# Altium schematic sheet CNC.SchDoc
size A2
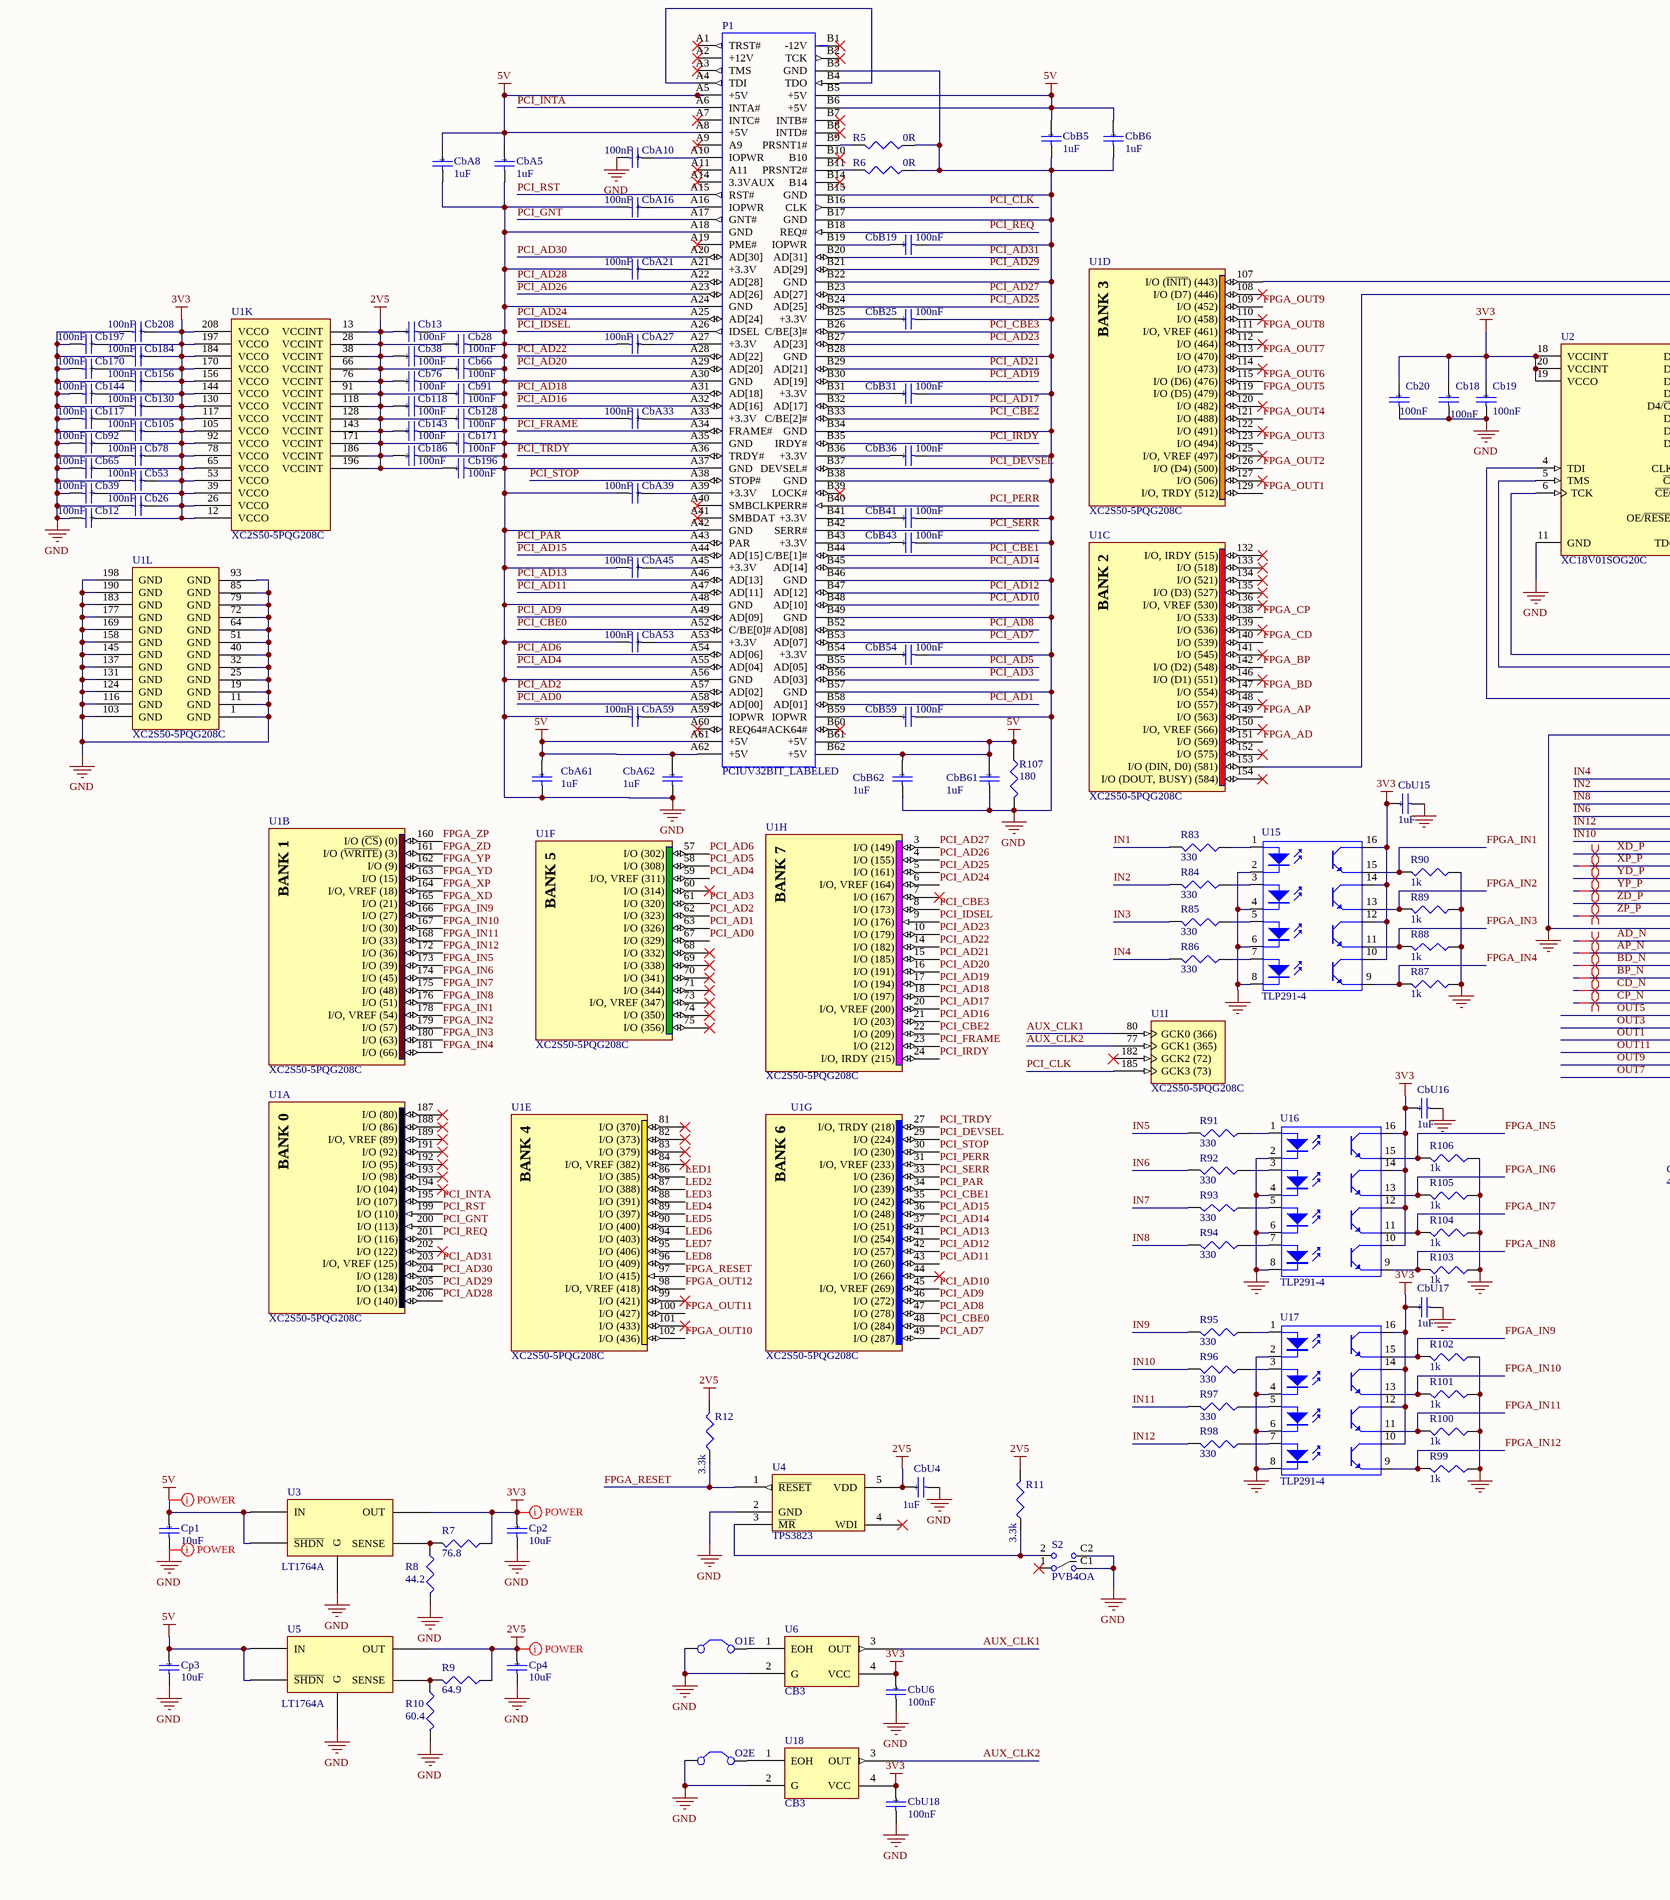
[diagram p0: CNC.SchDoc, bottom left]
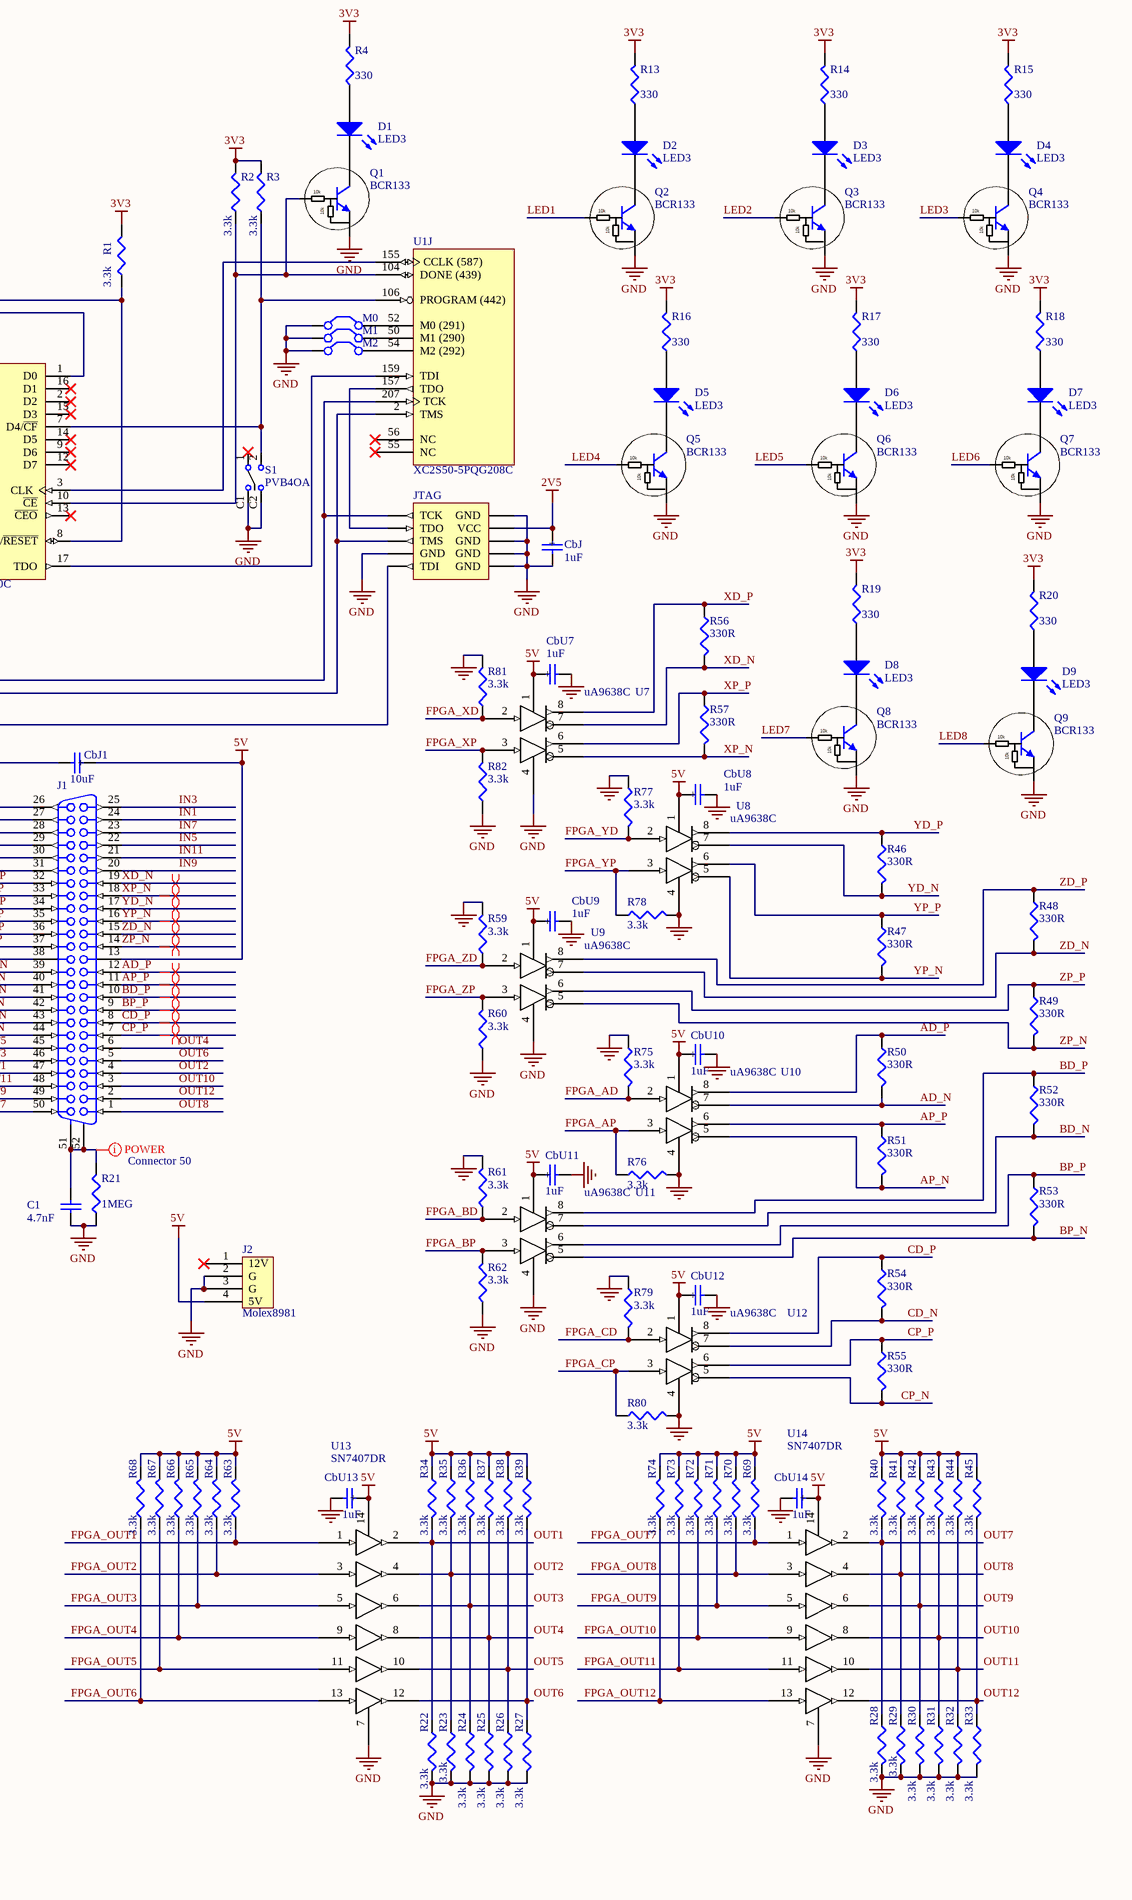
[diagram p1: CNC.SchDoc, bottom right]

## Parts
C1  4.7nF  [C1206]
Cb12  100nF  [C1206_POL]
Cb13  100nF  [C1206_POL]
Cb18  100nF  [C1206_POL]
Cb19  100nF  [C1206_POL]
Cb20  100nF  [C1206_POL]
Cb26  100nF  [C1206_POL]
Cb28  100nF  [C1206_POL]
Cb38  100nF  [C1206_POL]
Cb39  100nF  [C1206_POL]
Cb53  100nF  [C1206_POL]
Cb65  100nF  [C1206_POL]
Cb66  100nF  [C1206_POL]
Cb76  100nF  [C1206_POL]
Cb78  100nF  [C1206_POL]
Cb91  100nF  [C1206_POL]
Cb92  100nF  [C1206_POL]
Cb105  100nF  [C1206_POL]
Cb117  100nF  [C1206_POL]
Cb118  100nF  [C1206_POL]
Cb128  100nF  [C1206_POL]
Cb130  100nF  [C1206_POL]
Cb143  100nF  [C1206_POL]
Cb144  100nF  [C1206_POL]
Cb156  100nF  [C1206_POL]
Cb170  100nF  [C1206_POL]
Cb171  100nF  [C1206_POL]
Cb184  100nF  [C1206_POL]
Cb186  100nF  [C1206_POL]
Cb196  100nF  [C1206_POL]
Cb197  100nF  [C1206_POL]
Cb208  100nF  [C1206_POL]
CbA5  1uF  [C1206_POL]
CbA8  1uF  [C1206_POL]
CbA10  100nF  [C1206_POL]
CbA16  100nF  [C1206_POL]
CbA21  100nF  [C1206_POL]
CbA27  100nF  [C1206_POL]
CbA33  100nF  [C1206_POL]
CbA39  100nF  [C1206_POL]
CbA45  100nF  [C1206_POL]
CbA53  100nF  [C1206_POL]
CbA59  100nF  [C1206_POL]
CbA61  1uF  [C1206_POL]
CbA62  1uF  [C1206_POL]
CbB5  1uF  [C1206_POL]
CbB6  1uF  [C1206_POL]
CbB19  100nF  [C1206_POL]
CbB25  100nF  [C1206_POL]
CbB31  100nF  [C1206_POL]
CbB36  100nF  [C1206_POL]
CbB41  100nF  [C1206_POL]
CbB43  100nF  [C1206_POL]
CbB54  100nF  [C1206_POL]
CbB59  100nF  [C1206_POL]
CbB61  1uF  [C1206_POL]
CbB62  1uF  [C1206_POL]
CbJ  1uF  [C1206_POL]
CbJ1  10uF  [C1206_POL]
CbU4  1uF  [C1206_POL]
CbU6  100nF  [C1206_POL]
CbU7  1uF  [C1206_POL]
CbU8  1uF  [C1206_POL]
CbU9  1uF  [C1206_POL]
CbU10  1uF  [C1206_POL]
CbU11  1uF  [C1206_POL]
CbU12  1uF  [C1206_POL]
CbU13  1uF  [C1206_POL]
CbU14  1uF  [C1206_POL]
CbU15  1uF  [C1206_POL]
CbU16  1uF  [C1206_POL]
CbU17  1uF  [C1206_POL]
CbU18  100nF  [C1206_POL]
Cp1  10uF  [C1206_POL]
Cp2  10uF  [C1206_POL]
Cp3  10uF  [C1206_POL]
Cp4  10uF  [C1206_POL]
D1  LED3  [3.5X2.8X1.9]
D2  LED3  [3.5X2.8X1.9]
D3  LED3  [3.5X2.8X1.9]
D4  LED3  [3.5X2.8X1.9]
D5  LED3  [3.5X2.8X1.9]
D6  LED3  [3.5X2.8X1.9]
D7  LED3  [3.5X2.8X1.9]
D8  LED3  [3.5X2.8X1.9]
D9  LED3  [3.5X2.8X1.9]
J1  Connector 50  [SCSI50]
J2  Molex8981  [molex8981]
JTAG  JTAG  [HDR2X5]  (value not drawn)
M0  M0  [RAD-0.2]  (value not drawn)
M1  M0  [RAD-0.2]  (value not drawn)
M2  M0  [RAD-0.2]  (value not drawn)
O1E  M0  [RAD-0.2]  (value not drawn)
O2E  M0  [RAD-0.2]  (value not drawn)
P1  PCIUV32BIT_LABELED  [PCIUV32BIT]
Q1  BCR133  [SOT-23B_L]
Q2  BCR133  [SOT-23B_L]
Q3  BCR133  [SOT-23B_L]
Q4  BCR133  [SOT-23B_L]
Q5  BCR133  [SOT-23B_L]
Q6  BCR133  [SOT-23B_L]
Q7  BCR133  [SOT-23B_L]
Q8  BCR133  [SOT-23B_L]
Q9  BCR133  [SOT-23B_L]
R1  3.3k  [J1-0603]
R2  3.3k  [J1-0603]
R3  3.3k  [J1-0603]
R4  value 330  [J1-0603]  (hidden comment: 330R)
R5  0R  [J1-0603]
R6  0R  [J1-0603]
R7  value 76.8  [14-1210]  (hidden comment: 76.8R1%)
R8  value 44.2  [14-1210]  (hidden comment: 44.2R1%)
R9  value 64.9  [14-1210]  (hidden comment: 64.9R1%)
R10  value 60.4  [14-1210]  (hidden comment: 60.4R1%)
R11  3.3k  [J1-0603]
R12  3.3k  [J1-0603]
R13  value 330  [J1-0603]  (hidden comment: 330R)
R14  value 330  [J1-0603]  (hidden comment: 330R)
R15  value 330  [J1-0603]  (hidden comment: 330R)
R16  value 330  [J1-0603]  (hidden comment: 330R)
R17  value 330  [J1-0603]  (hidden comment: 330R)
R18  value 330  [J1-0603]  (hidden comment: 330R)
R19  value 330  [J1-0603]  (hidden comment: 330R)
R20  value 330  [J1-0603]  (hidden comment: 330R)
R21  value 1MEG  [J1-0603]  (hidden comment: 1M)
R22  3.3k  [J1-0603]
R23  3.3k  [J1-0603]
R24  3.3k  [J1-0603]
R25  3.3k  [J1-0603]
R26  3.3k  [J1-0603]
R27  3.3k  [J1-0603]
R28  3.3k  [J1-0603]
R29  3.3k  [J1-0603]
R30  3.3k  [J1-0603]
R31  3.3k  [J1-0603]
R32  3.3k  [J1-0603]
R33  3.3k  [J1-0603]
R34  3.3k  [J1-0603]
R35  3.3k  [J1-0603]
R36  3.3k  [J1-0603]
R37  3.3k  [J1-0603]
R38  3.3k  [J1-0603]
R39  3.3k  [J1-0603]
R40  3.3k  [J1-0603]
R41  3.3k  [J1-0603]
R42  3.3k  [J1-0603]
R43  3.3k  [J1-0603]
R44  3.3k  [J1-0603]
R45  3.3k  [J1-0603]
R46  330R  [J1-0603]
R47  330R  [J1-0603]
R48  330R  [J1-0603]
R49  330R  [J1-0603]
R50  330R  [J1-0603]
R51  330R  [J1-0603]
R52  330R  [J1-0603]
R53  330R  [J1-0603]
R54  330R  [J1-0603]
R55  330R  [J1-0603]
R56  330R  [J1-0603]
R57  330R  [J1-0603]
R59  3.3k  [J1-0603]
R60  3.3k  [J1-0603]
R61  3.3k  [J1-0603]
R62  3.3k  [J1-0603]
R63  3.3k  [J1-0603]
R64  3.3k  [J1-0603]
R65  3.3k  [J1-0603]
R66  3.3k  [J1-0603]
R67  3.3k  [J1-0603]
R68  3.3k  [J1-0603]
R69  3.3k  [J1-0603]
R70  3.3k  [J1-0603]
R71  3.3k  [J1-0603]
R72  3.3k  [J1-0603]
R73  3.3k  [J1-0603]
R74  3.3k  [J1-0603]
R75  3.3k  [J1-0603]
R76  3.3k  [J1-0603]
R77  3.3k  [J1-0603]
R78  3.3k  [J1-0603]
R79  3.3k  [J1-0603]
R80  3.3k  [J1-0603]
R81  3.3k  [J1-0603]
R82  3.3k  [J1-0603]
R83  value 330  [J1-0603]  (hidden comment: 330R)
R84  value 330  [J1-0603]  (hidden comment: 330R)
R85  value 330  [J1-0603]  (hidden comment: 330R)
R86  value 330  [J1-0603]  (hidden comment: 330R)
R87  1k  [J1-0603]
R88  1k  [J1-0603]
R89  1k  [J1-0603]
R90  1k  [J1-0603]
R91  value 330  [J1-0603]  (hidden comment: 330R)
R92  value 330  [J1-0603]  (hidden comment: 330R)
R93  value 330  [J1-0603]  (hidden comment: 330R)
R94  value 330  [J1-0603]  (hidden comment: 330R)
R95  value 330  [J1-0603]  (hidden comment: 330R)
R96  value 330  [J1-0603]  (hidden comment: 330R)
R97  value 330  [J1-0603]  (hidden comment: 330R)
R98  value 330  [J1-0603]  (hidden comment: 330R)
R99  1k  [J1-0603]
R100  1k  [J1-0603]
R101  1k  [J1-0603]
R102  1k  [J1-0603]
R103  1k  [J1-0603]
R104  1k  [J1-0603]
R105  1k  [J1-0603]
R106  1k  [J1-0603]
R107  value 180  [14-1210]  (hidden comment: 180R)
S1  PVB4OA  [PVB4]
S2  PVB4OA  [PVB4]
U1  XC2S50-5PQG208C  [PQG208_N]  (parts A,B,C,D,E,F,G,H,I,J,K,L of 12)
U2  XC18V01SOG20C  [SOG20_N]
U3  LT1764A  [LT1764A]
U4  TPS3823  [SOT23-5]
U5  LT1764A  [LT1764A]
U6  CB3  [CB3]
U7  uA9638C  [SO8_N]
U8  uA9638C  [SO8_N]
U9  uA9638C  [SO8_N]
U10  uA9638C  [SO8_N]
U11  uA9638C  [SO8_N]
U12  uA9638C  [SO8_N]
U13  SN7407DR  [SO14]
U14  SN7407DR  [SO14]
U15  TLP291-4  [TOSHIBA_11_11F1]
U16  TLP291-4  [TOSHIBA_11_11F1]
U17  TLP291-4  [TOSHIBA_11_11F1]
U18  CB3  [CB3]

## Nets
2V5: Cb13.- Cb28.- Cb38.- Cb66.- Cb76.- Cb91.- Cb118.- Cb128.- Cb143.- Cb171.- Cb186.- Cb196.- CbJ.- CbU4.- Cp4.- JTAG.4(VCC) R9.1 R11.2 R12.2 U1.13(VCCINT) U1.28(VCCINT) U1.38(VCCINT) U1.66(VCCINT) U1.76(VCCINT) U1.91(VCCINT) U1.118(VCCINT) U1.128(VCCINT) U1.143(VCCINT) U1.171(VCCINT) U1.186(VCCINT) U1.196(VCCINT) U4.5(VDD) U5.OUT
3V3: Cb12.- Cb18.- Cb19.- Cb20.- Cb26.- Cb39.- Cb53.- Cb65.- Cb78.- Cb92.- Cb105.- Cb117.- Cb130.- Cb144.- Cb156.- Cb170.- Cb184.- Cb197.- Cb208.- CbU6.- CbU15.- CbU16.- CbU17.- CbU18.- Cp2.- R1.2 R2.2 R3.2 R4.2 R7.1 R13.2 R14.2 R15.2 R16.2 R17.2 R18.2 R19.2 R20.2 U1.12(VCCO) U1.26(VCCO) U1.39(VCCO) U1.53(VCCO) U1.65(VCCO) U1.78(VCCO) U1.92(VCCO) U1.105(VCCO) U1.117(VCCO) U1.130(VCCO) U1.144(VCCO) U1.156(VCCO) U1.170(VCCO) U1.184(VCCO) U1.197(VCCO) U1.208(VCCO) U2.18(VCCINT) U2.19(VCCO) U2.20(VCCINT) U3.OUT U6.4(VCC) U15.10 U15.12 U15.14 U15.16 U16.10 U16.12 U16.14 U16.16 U17.10 U17.12 U17.14 U17.16 U18.4(VCC)
5V: CbA5.- CbA8.- CbA61.- CbA62.- CbB5.- CbB6.- CbB61.- CbB62.- CbJ1.- CbU7.- CbU8.- CbU9.- CbU10.- CbU11.- CbU12.- CbU13.- CbU14.- Cp1.- Cp3.- J1.13 J2.4(5V) P1.A5(+5V) P1.A8(+5V) P1.A61(+5V) P1.A62(+5V) P1.B5(+5V) P1.B6(+5V) P1.B61(+5V) P1.B62(+5V) R34.1 R35.1 R36.1 R37.1 R38.1 R39.1 R40.1 R41.1 R42.1 R43.1 R44.1 R45.1 R63.2 R64.2 R65.2 R66.2 R67.2 R68.2 R69.2 R70.2 R71.2 R72.2 R73.2 R74.2 R107.1 U3.IN U3.SHDN(~{SHDN}) U5.IN U5.SHDN(~{SHDN}) U7.1 U8.1 U9.1 U10.1 U11.1 U12.1 U13.14 U14.14
GND: C1.1 Cb12.+ Cb13.+ Cb18.+ Cb19.+ Cb20.+ Cb26.+ Cb28.+ Cb38.+ Cb39.+ Cb53.+ Cb65.+ Cb66.+ Cb76.+ Cb78.+ Cb91.+ Cb92.+ Cb105.+ Cb117.+ Cb118.+ Cb128.+ Cb130.+ Cb143.+ Cb144.+ Cb156.+ Cb170.+ Cb171.+ Cb184.+ Cb186.+ Cb196.+ Cb197.+ Cb208.+ CbA5.+ CbA8.+ CbA10.+ CbA16.+ CbA21.+ CbA27.+ CbA33.+ CbA39.+ CbA45.+ CbA53.+ CbA59.+ CbA61.+ CbA62.+ CbB5.+ CbB6.+ CbB19.+ CbB25.+ CbB31.+ CbB36.+ CbB41.+ CbB43.+ CbB54.+ CbB59.+ CbB61.+ CbB62.+ CbJ.+ CbJ1.+ CbU4.+ CbU6.+ CbU7.+ CbU8.+ CbU9.+ CbU10.+ CbU11.+ CbU12.+ CbU13.+ CbU14.+ CbU15.+ CbU16.+ CbU17.+ CbU18.+ Cp1.+ Cp2.+ Cp3.+ Cp4.+ J1.38 J2.2(G) J2.3(G) JTAG.2(GND) JTAG.6(GND) JTAG.7(GND) JTAG.8(GND) JTAG.10(GND) M0.1(C1) M1.1(C1) M2.1(C1) O1E.1(C1) O2E.1(C1) P1.A18(GND) P1.A24(GND) P1.A30(GND) P1.A35(GND) P1.A37(GND) P1.A42(GND) P1.A48(GND) P1.A56(GND) P1.B3(GND) P1.B15(GND) P1.B17(GND) P1.B22(GND) P1.B28(GND) P1.B34(GND) P1.B38(GND) P1.B46(GND) P1.B49(GND) P1.B57(GND) Q1.2(E) Q2.2(E) Q3.2(E) Q4.2(E) Q5.2(E) Q6.2(E) Q7.2(E) Q8.2(E) Q9.2(E) R5.1 R6.1 R8.2 R10.2 R21.1 R22.2 R23.2 R24.2 R25.2 R26.2 R27.2 R28.2 R29.2 R30.2 R31.2 R32.2 R33.2 R59.2 R60.1 R61.2 R62.1 R75.1 R76.2 R77.1 R78.2 R79.1 R80.2 R81.2 R82.1 R87.1 R88.1 R89.1 R90.1 R99.1 R100.1 R101.1 R102.1 R103.1 R104.1 R105.1 R106.1 R107.2 S1.C1 S1.C2 S2.C1 S2.C2 U1.1(GND) U1.11(GND) U1.19(GND) U1.25(GND) U1.32(GND) U1.40(GND) U1.51(GND) U1.64(GND) U1.72(GND) U1.79(GND) U1.85(GND) U1.93(GND) U1.103(GND) U1.116(GND) U1.124(GND) U1.131(GND) U1.137(GND) U1.145(GND) U1.158(GND) U1.169(GND) U1.177(GND) U1.183(GND) U1.190(GND) U1.198(GND) U2.11(GND) U3.G U4.2(GND) U5.G U6.2(G) U7.4 U8.4 U9.4 U10.4 U11.4 U12.4 U13.7 U14.7 U15.2 U15.4 U15.6 U15.8 U16.2 U16.4 U16.6 U16.8 U17.2 U17.4 U17.6 U17.8 U18.2(G)
AD_N: J1.39 R50.2 U10.7
AD_P: J1.12 R50.1 U10.8
AP_N: J1.40 R51.2 U10.5
AP_P: J1.11 R51.1 U10.6
AUX_CLK1: U1.80(GCK0_(366)) U6.3(OUT)
AUX_CLK2: U1.77(GCK1_(365)) U18.3(OUT)
BD_N: J1.41 R52.2 U11.7
BD_P: J1.10 R52.1 U11.8
BP_N: J1.42 R53.2 U11.5
BP_P: J1.9 R53.1 U11.6
CD_N: J1.43 R54.2 U12.7
CD_P: J1.8 R54.1 U12.8
CP_N: J1.44 R55.2 U12.5
CP_P: J1.7 R55.1 U12.6
FPGA_AD: R75.2 U1.151(I/O_(569)) U10.2
FPGA_AP: R76.1 U1.149(I/O_(563)) U10.3
FPGA_BD: R61.1 U1.147(I/O_(554)) U11.2
FPGA_BP: R62.2 U1.142(I/O_(D2)_(548)) U11.3
FPGA_CD: R79.2 U1.140(I/O_(539)) U12.2
FPGA_CP: R80.1 U1.138(I/O_(533)) U12.3
FPGA_IN1: R90.2 U1.178(I/O,_VREF_(54)) U15.15
FPGA_IN2: R89.2 U1.179(I/O_(57)) U15.13
FPGA_IN3: R88.2 U1.180(I/O_(63)) U15.11
FPGA_IN4: R87.2 U1.181(I/O_(66)) U15.9
FPGA_IN5: R106.2 U1.173(I/O_(39)) U16.15
FPGA_IN6: R105.2 U1.174(I/O_(45)) U16.13
FPGA_IN7: R104.2 U1.175(I/O_(48)) U16.11
FPGA_IN8: R103.2 U1.176(I/O_(51)) U16.9
FPGA_IN9: R102.2 U1.166(I/O_(27)) U17.15
FPGA_IN10: R101.2 U1.167(I/O_(30)) U17.13
FPGA_IN11: R100.2 U1.168(I/O_(33)) U17.11
FPGA_IN12: R99.2 U1.172(I/O_(36)) U17.9
FPGA_OUT1: R63.1 U1.129(I/O,_TRDY_(512)) U13.1
FPGA_OUT2: R64.1 U1.126(I/O_(D4)_(500)) U13.3
FPGA_OUT3: R65.1 U1.123(I/O_(494)) U13.5
FPGA_OUT4: R66.1 U1.121(I/O_(488)) U13.9
FPGA_OUT5: R67.1 U1.119(I/O_(D5)_(479)) U13.11
FPGA_OUT6: R68.1 U1.115(I/O_(D6)_(476)) U13.13
FPGA_OUT7: R69.1 U1.113(I/O_(470)) U14.1
FPGA_OUT8: R70.1 U1.111(I/O,_VREF_(461)) U14.3
FPGA_OUT9: R71.1 U1.109(I/O_(452)) U14.5
FPGA_OUT10: R72.1 U1.102(I/O_(436)) U14.9
FPGA_OUT11: R73.1 U1.100(I/O_(427)) U14.11
FPGA_OUT12: R74.1 U1.98(I/O,_VREF_(418)) U14.13
FPGA_RESET: R12.1 U1.97(I/O_(415)) U4.1(~{RESET})
FPGA_XD: R81.1 U1.165(I/O_(21)) U7.2
FPGA_XP: R82.2 U1.164(I/O,_VREF_(18)) U7.3
FPGA_YD: R77.2 U1.163(I/O_(15)) U8.2
FPGA_YP: R78.1 U1.162(I/O_(9)) U8.3
FPGA_ZD: R59.1 U1.161(I/O_(~{WRITE})_(3)) U9.2
FPGA_ZP: R60.2 U1.160(I/O_(~{CS})_(0)) U9.3
IN1: J1.24 R83.2
IN2: J1.27 R84.2
IN3: J1.25 R85.2
IN4: J1.26 R86.2
IN5: J1.22 R91.2
IN6: J1.29 R92.2
IN7: J1.23 R93.2
IN8: J1.28 R94.2
IN9: J1.20 R95.2
IN10: J1.31 R96.2
IN11: J1.21 R97.2
IN12: J1.30 R98.2
LED1: Q2.1(B) U1.86(I/O_(385))
LED2: Q3.1(B) U1.87(I/O_(388))
LED3: Q4.1(B) U1.88(I/O_(391))
LED4: Q5.1(B) U1.89(I/O_(397))
LED5: Q6.1(B) U1.90(I/O_(400))
LED6: Q7.1(B) U1.94(I/O_(403))
LED7: Q8.1(B) U1.95(I/O_(406))
LED8: Q9.1(B) U1.96(I/O_(409))
OUT1: J1.47 R22.1 R34.2 U13.2
OUT2: J1.4 R23.1 R35.2 U13.4
OUT3: J1.46 R24.1 R36.2 U13.6
OUT4: J1.6 R25.1 R37.2 U13.8
OUT5: J1.45 R26.1 R38.2 U13.10
OUT6: J1.5 R27.1 R39.2 U13.12
OUT7: J1.50 R28.1 R40.2 U14.2
OUT8: J1.1 R29.1 R41.2 U14.4
OUT9: J1.49 R30.1 R42.2 U14.6
OUT10: J1.3 R31.1 R43.2 U14.8
OUT11: J1.48 R32.1 R44.2 U14.10
OUT12: J1.2 R33.1 R45.2 U14.12
PCI_AD0: P1.A58(AD[00]) U1.67(I/O_(329))
PCI_AD1: P1.B58(AD[01]) U1.63(I/O_(326))
PCI_AD2: P1.A57(AD[02]) U1.62(I/O_(323))
PCI_AD3: P1.B56(AD[03]) U1.61(I/O_(320))
PCI_AD4: P1.A55(AD[04]) U1.59(I/O,_VREF_(311))
PCI_AD5: P1.B55(AD[05]) U1.58(I/O_(308))
PCI_AD6: P1.A54(AD[06]) U1.57(I/O_(302))
PCI_AD7: P1.B53(AD[07]) U1.49(I/O_(287))
PCI_AD8: P1.B52(AD[08]) U1.47(I/O_(278))
PCI_AD9: P1.A49(AD[09]) U1.46(I/O_(272))
PCI_AD10: P1.B48(AD[10]) U1.45(I/O,_VREF_(269))
PCI_AD11: P1.A47(AD[11]) U1.43(I/O_(260))
PCI_AD12: P1.B47(AD[12]) U1.42(I/O_(257))
PCI_AD13: P1.A46(AD[13]) U1.41(I/O_(254))
PCI_AD14: P1.B45(AD[14]) U1.37(I/O_(251))
PCI_AD15: P1.A44(AD[15]) U1.36(I/O_(248))
PCI_AD16: P1.A32(AD[16]) U1.21(I/O_(203))
PCI_AD17: P1.B32(AD[17]) U1.20(I/O,_VREF_(200))
PCI_AD18: P1.A31(AD[18]) U1.18(I/O_(197))
PCI_AD19: P1.B30(AD[19]) U1.17(I/O_(194))
PCI_AD20: P1.A29(AD[20]) U1.16(I/O_(191))
PCI_AD21: P1.B29(AD[21]) U1.15(I/O_(185))
PCI_AD22: P1.A28(AD[22]) U1.14(I/O_(182))
PCI_AD23: P1.B27(AD[23]) U1.10(I/O_(179))
PCI_AD24: P1.A25(AD[24]) U1.6(I/O,_VREF_(164))
PCI_AD25: P1.B24(AD[25]) U1.5(I/O_(161))
PCI_AD26: P1.A23(AD[26]) U1.4(I/O_(155))
PCI_AD27: P1.B23(AD[27]) U1.3(I/O_(149))
PCI_AD28: P1.A22(AD[28]) U1.206(I/O_(140))
PCI_AD29: P1.B21(AD[29]) U1.205(I/O_(134))
PCI_AD30: P1.A20(AD[30]) U1.204(I/O_(128))
PCI_AD31: P1.B20(AD[31]) U1.203(I/O,_VREF_(125))
PCI_CBE0: P1.A52(C/BE[0]#) U1.48(I/O_(284))
PCI_CBE1: P1.B44(C/BE[1]#) U1.35(I/O_(242))
PCI_CBE2: P1.B33(C/BE[2]#) U1.22(I/O_(209))
PCI_CBE3: P1.B26(C/BE[3]#) U1.8(I/O_(173))
PCI_CLK: P1.B16(CLK) U1.185(GCK3_(73))
PCI_DEVSEL: P1.B37(DEVSEL#) U1.29(I/O_(224))
PCI_FRAME: P1.A34(FRAME#) U1.23(I/O_(212))
PCI_GNT: P1.A17(GNT#) U1.200(I/O_(113))
PCI_IDSEL: P1.A26(IDSEL) U1.9(I/O_(176))
PCI_INTA: P1.A6(INTA#) U1.195(I/O_(107))
PCI_IRDY: P1.B35(IRDY#) U1.24(I/O,_IRDY_(215))
PCI_PAR: P1.A43(PAR) U1.34(I/O_(239))
PCI_PERR: P1.B40(PERR#) U1.31(I/O,_VREF_(233))
PCI_REQ: P1.B18(REQ#) U1.201(I/O_(116))
PCI_RST: P1.A15(RST#) U1.199(I/O_(110))
PCI_SERR: P1.B42(SERR#) U1.33(I/O_(236))
PCI_STOP: P1.A38(STOP#) U1.30(I/O_(230))
PCI_TRDY: P1.A36(TRDY#) U1.27(I/O,_TRDY_(218))
XD_N: J1.19 R56.2 U7.7
XD_P: J1.32 R56.1 U7.8
XP_N: J1.18 R57.2 U7.5
XP_P: J1.33 R57.1 U7.6
YD_N: J1.17 R46.2 U8.7
YD_P: J1.34 R46.1 U8.8
YP_N: J1.16 R47.2 U8.5
YP_P: J1.35 R47.1 U8.6
ZD_N: J1.15 R48.2 U9.7
ZD_P: J1.36 R48.1 U9.8
ZP_N: J1.14 R49.2 U9.5
ZP_P: J1.37 R49.1 U9.6
NetC1_2: C1.2 J1.51(MH1) J1.52(MH2) R21.2
NetCbA10_-: CbA10.- P1.A10(IOPWR)
NetCbA16_-: CbA16.- P1.A16(IOPWR)
NetCbA21_-: CbA21.- P1.A21(+3.3V)
NetCbA27_-: CbA27.- P1.A27(+3.3V)
NetCbA33_-: CbA33.- P1.A33(+3.3V)
NetCbA39_-: CbA39.- P1.A39(+3.3V)
NetCbA45_-: CbA45.- P1.A45(+3.3V)
NetCbA53_-: CbA53.- P1.A53(+3.3V)
NetCbA59_-: CbA59.- P1.A59(IOPWR)
NetCbB19_-: CbB19.- P1.B19(IOPWR)
NetCbB25_-: CbB25.- P1.B25(+3.3V)
NetCbB31_-: CbB31.- P1.B31(+3.3V)
NetCbB36_-: CbB36.- P1.B36(+3.3V)
NetCbB41_-: CbB41.- P1.B41(+3.3V)
NetCbB43_-: CbB43.- P1.B43(+3.3V)
NetCbB54_-: CbB54.- P1.B54(+3.3V)
NetCbB59_-: CbB59.- P1.B59(IOPWR)
NetD1_1: D1.1(A) R4.1
NetD1_2: D1.2(K) Q1.3(C)
NetD2_1: D2.1(A) R13.1
NetD2_2: D2.2(K) Q2.3(C)
NetD3_1: D3.1(A) R14.1
NetD3_2: D3.2(K) Q3.3(C)
NetD4_1: D4.1(A) R15.1
NetD4_2: D4.2(K) Q4.3(C)
NetD5_1: D5.1(A) R16.1
NetD5_2: D5.2(K) Q5.3(C)
NetD6_1: D6.1(A) R17.1
NetD6_2: D6.2(K) Q6.3(C)
NetD7_1: D7.1(A) R18.1
NetD7_2: D7.2(K) Q7.3(C)
NetD8_1: D8.1(A) R19.1
NetD8_2: D8.2(K) Q8.3(C)
NetD9_1: D9.1(A) R20.1
NetD9_2: D9.2(K) Q9.3(C)
NetJTAG_1: JTAG.1(TCK) U1.207(TCK) U2.6(TCK)
NetJTAG_3: JTAG.3(TDO) U1.157(TDO)
NetJTAG_5: JTAG.5(TMS) U1.2(TMS) U2.5(TMS)
NetJTAG_9: JTAG.9(TDI) U2.4(TDI)
NetM0_2: M0.2(C2) U1.52(M0_(291))
NetM1_2: M1.2(C2) U1.50(M1_(290))
NetM2_2: M2.2(C2) U1.54(M2_(292))
NetO1E_2: O1E.2(C2) U6.1(EOH)
NetO2E_2: O2E.2(C2) U18.1(EOH)
NetP1_A4: P1.A4(TDI) P1.B4(TDO)
NetP1_B9: P1.B9(PRSNT1#) R5.2
NetP1_B11: P1.B11(PRSNT2#) R6.2
NetQ1_1: Q1.1(B) R2.1 U1.104(DONE_(439)) U2.10(~{CE})
NetR1_1: R1.1 U1.107(I/O_(~{INIT})_(443)) U2.8(OE/~{RESET})
NetR3_1: R3.1 S1.2 U1.106(PROGRAM_(442)) U2.7(D4/~{CF})
NetR7_2: R7.2 R8.1 U3.SENSE
NetR9_2: R9.2 R10.1 U5.SENSE
NetR11_1: R11.1 S2.2 U4.3(~{MR})
NetR83_1: R83.1 U15.1
NetR84_1: R84.1 U15.3
NetR85_1: R85.1 U15.5
NetR86_1: R86.1 U15.7
NetR91_1: R91.1 U16.1
NetR92_1: R92.1 U16.3
NetR93_1: R93.1 U16.5
NetR94_1: R94.1 U16.7
NetR95_1: R95.1 U17.1
NetR96_1: R96.1 U17.3
NetR97_1: R97.1 U17.5
NetR98_1: R98.1 U17.7
NetU1_153: U1.153(I/O_(DIN,_D0)_(581)) U2.1(D0)
NetU1_155: U1.155(CCLK_(587)) U2.3(CLK)
NetU1_159: U1.159(TDI) U2.17(TDO)

Not connected (* = marked no-connect by the designer): J2 1(12V)*; P1 A1(TRST#)* A2(+12V)* A3(TMS)* A7(INTC#)* A9* A11* A14(3.3VAUX)* A19(PME#)* A40(SMBCLK)* A41(SMBDAT)* A60(REQ64#)* B1(-12V)* B2(TCK)* B7(INTB#)* B8(INTD#)* B10* B14* B39(LOCK#)* B60(ACK64#)*; S1 1*; S2 1*; U1 7(I/O_(167))* 44(I/O_(266))* 55(NC)* 56(NC)* 60(I/O_(314))* 68(I/O_(332))* 69(I/O_(338))* 70(I/O_(341))* 71(I/O_(344))* 73(I/O,_VREF_(347))* 74(I/O_(350))* 75(I/O_(356))* 81(I/O_(370))* 82(I/O_(373))* 83(I/O_(379))* 84(I/O,_VREF_(382))* 99(I/O_(421))* 101(I/O_(433))* 108(I/O_(D7)_(446))* 110(I/O_(458))* 112(I/O_(464))* 114(I/O_(473))* 120(I/O_(482))* 122(I/O_(491))* 125(I/O,_VREF_(497))* 127(I/O_(506))* 132(I/O,_IRDY_(515))* 133(I/O_(518))* 134(I/O_(521))* 135(I/O_(D3)_(527))* 136(I/O,_VREF_(530))* 139(I/O_(536))* 141(I/O_(545))* 146(I/O_(D1)_(551))* 148(I/O_(557))* 150(I/O,_VREF_(566))* 152(I/O_(575))* 154(I/O_(DOUT,_BUSY)_(584))* 182(GCK2_(72))* 187(I/O_(80))* 188(I/O_(86))* 189(I/O,_VREF_(89))* 191(I/O_(92))* 192(I/O_(95))* 193(I/O_(98))* 194(I/O_(104))* 202(I/O_(122))*; U2 2(D2)* 9(D6)* 12(D7)* 13(~{CEO})* 14(D5)* 15(D3)* 16(D1)*; U4 4(WDI)*

## Layout directives
differential pair: AD_N, AD_P, AP_N, AP_P, BD_N, BD_P, BP_N, BP_P, CD_N, CD_P, CP_N, CP_P, XD_N, XD_P, XP_N, XP_P, YD_N, YD_P, YP_N, YP_P, ZD_N, ZD_P, ZP_N, ZP_P
net class POWER: 2V5, 3V3, 5V, GND, NetC1_2

## Notes on the sheet
- (in symbol BCR133) 10k
- (in symbol XC2S50-5PQG208C, part A) BANK 0
- (in symbol XC2S50-5PQG208C, part B) BANK 1
- (in symbol XC2S50-5PQG208C, part C) BANK 2
- (in symbol XC2S50-5PQG208C, part D) BANK 3
- (in symbol XC2S50-5PQG208C, part E) BANK 4
- (in symbol XC2S50-5PQG208C, part F) BANK 5
- (in symbol XC2S50-5PQG208C, part G) BANK 6
- (in symbol XC2S50-5PQG208C, part H) BANK 7

## Library data of the parts
C1 Cb12 Cb13 Cb18-Cb20 Cb26 Cb28 Cb38 Cb39 Cb53 Cb65 Cb66 Cb76 Cb78 Cb91 Cb92 Cb105 Cb117 Cb118 Cb128 Cb130 Cb143 Cb144 Cb156 Cb170 Cb171 Cb184 Cb186 Cb196 Cb197 Cb208 CbA5 CbA8 CbA10 CbA16 CbA21 CbA27 CbA33 CbA39 CbA45 CbA53 CbA59 CbA61 CbA62 CbB5 CbB6 CbB19 CbB25 CbB31 CbB36 CbB41 CbB43 CbB54 CbB59 CbB61 CbB62 CbJ CbJ1 CbU4 CbU6-CbU18 Cp1-Cp4 = Cap Semi: Capacitor (Semiconductor SIM Model); Published: 8-Jun-2000; LatestRevisionDate: 29-May-2009; LatestRevisionNote: IPC-7351 Footprint Added.; PackageReference: C1206; Publisher: Altium Limited; PackageDescription: Chip Capacitor
  C1: Value: 4.7nF
  Cb12 Cb13 Cb18-Cb20 Cb26 Cb28 Cb38 Cb39 Cb53 Cb65 Cb66 Cb76 Cb78 Cb91 Cb92 Cb105 Cb117 Cb118 Cb128 Cb130 Cb143 Cb144 Cb156 Cb170 Cb171 Cb184 Cb186 Cb196 Cb197 Cb208 CbA10 CbA16 CbA21 CbA27 CbA33 CbA39 CbA45 CbA53 CbA59 CbB19 CbB25 CbB31 CbB36 CbB41 CbB43 CbB54 CbB59 CbU6 CbU18: Value: 100nF
  CbA5 CbA8 CbA61 CbA62 CbB5 CbB6 CbB61 CbB62 CbJ CbU4 CbU7-CbU17: Value: 1uF
  CbJ1 Cp1-Cp4: Value: 10uF
D1-D9 = LED3: Typical BLUE SiC LED; Published: 8-Jun-2000; LatestRevisionDate: 17-Dec-2003; LatestRevisionNote: PCB Footprint replaced.; DatasheetVersion: 16-Apr-2002; PackageVersion: 16-Apr-2002; PackageReference: 3.5X2.8X1.9; Publisher: Altium Limited; PackageDescription: SM LED; 2 C-Bend Leads; Body 3.5 x 2.8 x 1.9 mm, inc leads (LxWxH typ)
J1 = Connector 50: Receptacle Header Assemby; PackageDocument: B; Positions: 50; Published: 15-Jun-2001; LatestRevisionDate: 17-Jul-2002; LatestRevisionNote: Re-released for DXP Platform.; DatasheetDocument: 1-Oct-1983; PackageReference: 178240-7; Publisher: Altium Limited; Orientation: Right Angle
JTAG = JTAG: Header, 5-Pin, Dual row; LatestRevisionDate: 17-Jul-2002; LatestRevisionNote: Re-released for DXP Platform.; Publisher: Altium Limited
M0-M2 O1E O2E = Jumper: Jumper Wire; Published: 24-Mar-1999; LatestRevisionDate: 17-Jul-2002; LatestRevisionNote: Re-released for DXP Platform.; PackageReference: RAD-0.2; Publisher: Altium Limited; PackageDescription: Radial Cap, Thru-Hole; 2 Leads; 0.2 in Pin Spacing
P1 = PCIUV32BIT_LABELED: Card, 116-Position; Text Field6: Pins A12, A13, B12, B13, A50, A51, B50 & B51 are not present.  Alternate Layout Available; Text Field7: Published 14-Feb-2002
Q1-Q9 = BCR133: NPN Bipolar Transistor; Published: 8-Jun-2000; LatestRevisionDate: 29-May-2009; LatestRevisionNote: IPC-7351 Footprint Added.; PackageVersion: Aug-1999; PackageReference: SOT-23B; Publisher: Altium Limited; PackageDescription: 3-Pin SOT-23 Package 0.95 mm Pitch, 2.4 mm Lead Span
R1-R57 R59-R107 = Res3: Resistor; Published: 8-Jun-2000; LatestRevisionDate: 29-May-2009; LatestRevisionNote: IPC-7351 Footprint Added.; PackageReference: J1-0603; Publisher: Altium Limited; PackageDescription: Chip Resistor
  R1-R3 R11 R12 R22-R45 R59-R82: Value: 3.3k
  R5 R6: Value: 0R
  R46-R57: Value: 330R
  R87-R90 R99-R106: Value: 1k
S1 S2 = PVB4OA: Tactile Switch, DPST; Thru-Hole; Vertical; Rating DC 12V, 50mA (max); PackageDocument: Rev.0; Published: 6-Jun-2005; DatasheetDocument: Rev.0; PackageReference: IT-2175; Publisher: Altium Limited; ComponentLink1Description: Manufacturer Link; ComponentLink1URL: http://www.ilswitch.com/; ComponentLink2Description: Device Overview; ComponentLink2URL: http://www.ilswitch.com/list.php?ac_id=010112&ai_id=91
U1 = XC2S50-5PQG208C: Spartan-II 2.5V FPGA, 140 User I/Os, 208-Pin PQFP, Standard Performance, Commercial Grade, Pb-Free; Published: 2-Mar-2006; LatestRevisionDate: 16-Nov-2009; LatestRevisionNote: Updated to datasheet version 2.8 Jun-2008.; DatasheetVersion: ver2.8, Jun-2008; PackageVersion: ver1.2, Jun-2004; PackageReference: PQG208; Publisher: Altium Limited; PackageDescription: 208-Pin Plastic Quad Flat Pack (PQG208) - Pb-Free; Supplier 1: Digi-Key; Supplier Part Number 1: 122-1320-ND; Code_JEDEC: MS-029-FA-1; ComponentLink1Description: Spartan-II Datasheet; ComponentLink1URL: http://www.xilinx.com/support/documentation/data_sheets/ds001.pdf; ComponentLink2Description: PQG208 Package Drawing; ComponentLink2URL: http://www.xilinx.com/support/documentation/package_specs/pq208.pdf; ComponentLink3Description: Spartan-II Documents; ComponentLink3URL: http://www.xilinx.com/support/documentation/spartan-ii.htm; ComponentLink4Description: Xilinx.com Home; ComponentLink4URL: http://www.xilinx.com
U2 = XC18V01SOG20C: XC18V00 Series, In-System Programmable Configuration 3.3V PROM, 20-Pin SOIC, 1-Megabit, Commercial Grade, Pb-Free; Note: For devices with IDCODES 0503x093h VCCINT pin 20 is a no connect (NC) pin.; Published: 2-Mar-2006; LatestRevisionDate: 16-Nov-2009; LatestRevisionNote: Updated to datasheet version 5.2, Jan-2008.; DatasheetVersion: ver5.2, Jan-2008; PackageVersion: ver1.0, Jun-2000; PackageReference: SOG20; Publisher: Altium Limited; PackageDescription: 20-Pin Small Outline Package (SOG20) - Pb-Free; Supplier 1: Digi-Key; Supplier Part Number 1: 122-1464-ND; Code_JEDEC: MS-013-AC; ComponentLink1Description: XC18V00 Series Datasheet; ComponentLink1URL: http://www.xilinx.com/support/documentation/data_sheets/ds026.pdf; ComponentLink2Description: SOG20 Package Drawing; ComponentLink2URL: http://www.xilinx.com/support/documentation/package_specs/so20.pdf; ComponentLink3Description: Configuration PROM Documents; ComponentLink3URL: http://www.xilinx.com/support/documentation/configuration_proms.htm; ComponentLink4Description: Xilinx.com Home; ComponentLink4URL: http://www.xilinx.com
U15-U17 = TLP291-4: 4-Pin Phototransistor Optocoupler; Published: 24-Mar-1999; LatestRevisionDate: 04-Mar-2005; LatestRevisionNote: Sch pins 3 & 4 Swapped.; DatasheetVersion: Nov-2003; PackageReference: DIP-4; Publisher: Altium Limited